# EAGLE design Monitor_strip_5050 (EAGLE 7.3.0)
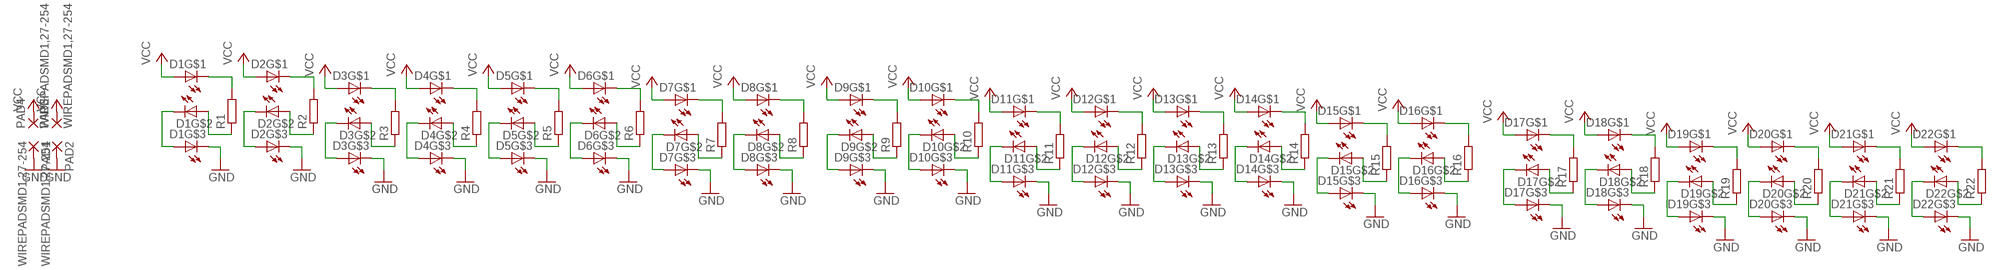
[diagram p0: schematic, sheet 1]

## Parts
D1  LED5050_SEPARATES  [LED505_SMALLPADS]
D2  LED5050_SEPARATES  [LED505_SMALLPADS]
D3  LED5050_SEPARATES  [LED505_SMALLPADS]
D4  LED5050_SEPARATES  [LED505_SMALLPADS]
D5  LED5050_SEPARATES  [LED505_SMALLPADS]
D6  LED5050_SEPARATES  [LED505_SMALLPADS]
D7  LED5050_SEPARATES  [LED505_SMALLPADS]
D8  LED5050_SEPARATES  [LED505_SMALLPADS]
D9  LED5050_SEPARATES  [LED505_SMALLPADS]
D10  LED5050_SEPARATES  [LED505_SMALLPADS]
D11  LED5050_SEPARATES  [LED505_SMALLPADS]
D12  LED5050_SEPARATES  [LED505_SMALLPADS]
D13  LED5050_SEPARATES  [LED505_SMALLPADS]
D14  LED5050_SEPARATES  [LED505_SMALLPADS]
D15  LED5050_SEPARATES  [LED505_SMALLPADS]
D16  LED5050_SEPARATES  [LED505_SMALLPADS]
D17  LED5050_SEPARATES  [LED505_SMALLPADS]
D18  LED5050_SEPARATES  [LED505_SMALLPADS]
D19  LED5050_SEPARATES  [LED505_SMALLPADS]
D20  LED5050_SEPARATES  [LED505_SMALLPADS]
D21  LED5050_SEPARATES  [LED505_SMALLPADS]
D22  LED5050_SEPARATES  [LED505_SMALLPADS]
PAD1  WIREPADSMD1,27-254  [SMD1,27-2,54]
PAD2  WIREPADSMD1,27-254  [SMD1,27-2,54]
PAD3  WIREPADSMD1,27-254  [SMD1,27-2,54]
PAD4  WIREPADSMD1,27-254  [SMD1,27-2,54]
R1  R-EU_R0805  [R0805]
R2  R-EU_R0805  [R0805]
R3  R-EU_R0805  [R0805]
R4  R-EU_R0805  [R0805]
R5  R-EU_R0805  [R0805]
R6  R-EU_R0805  [R0805]
R7  R-EU_R0805  [R0805]
R8  R-EU_R0805  [R0805]
R9  R-EU_R0805  [R0805]
R10  R-EU_R0805  [R0805]
R11  R-EU_R0805  [R0805]
R12  R-EU_R0805  [R0805]
R13  R-EU_R0805  [R0805]
R14  R-EU_R0805  [R0805]
R15  R-EU_R0805  [R0805]
R16  R-EU_R0805  [R0805]
R17  R-EU_R0805  [R0805]
R18  R-EU_R0805  [R0805]
R19  R-EU_R0805  [R0805]
R20  R-EU_R0805  [R0805]
R21  R-EU_R0805  [R0805]
R22  R-EU_R0805  [R0805]

## Nets
GND: D1.P$3(C) D2.P$3(C) D3.P$3(C) D4.P$3(C) D5.P$3(C) D6.P$3(C) D7.P$3(C) D8.P$3(C) D9.P$3(C) D10.P$3(C) D11.P$3(C) D12.P$3(C) D13.P$3(C) D14.P$3(C) D15.P$3(C) D16.P$3(C) D17.P$3(C) D18.P$3(C) D19.P$3(C) D20.P$3(C) D21.P$3(C) D22.P$3(C) PAD1.1(P) PAD2.1(P)
N$1: D1.P$1(C) R1.2
N$2: D1.P$5(A) R1.1
N$3: D2.P$2(C) D2.P$4(A)
N$4: D2.P$1(C) R2.2
N$5: D2.P$5(A) R2.1
N$6: D3.P$2(C) D3.P$4(A)
N$7: D3.P$1(C) R3.2
N$8: D3.P$5(A) R3.1
N$9: D4.P$2(C) D4.P$4(A)
N$10: D1.P$2(C) D1.P$4(A)
N$11: D4.P$1(C) R4.2
N$12: D4.P$5(A) R4.1
N$13: D5.P$2(C) D5.P$4(A)
N$14: D5.P$1(C) R5.2
N$15: D5.P$5(A) R5.1
N$16: D6.P$2(C) D6.P$4(A)
N$17: D6.P$1(C) R6.2
N$18: D6.P$5(A) R6.1
N$19: D7.P$2(C) D7.P$4(A)
N$20: D7.P$1(C) R7.2
N$21: D7.P$5(A) R7.1
N$22: D8.P$2(C) D8.P$4(A)
N$23: D8.P$1(C) R8.2
N$24: D8.P$5(A) R8.1
N$25: D9.P$2(C) D9.P$4(A)
N$26: D9.P$1(C) R9.2
N$27: D9.P$5(A) R9.1
N$28: D10.P$2(C) D10.P$4(A)
N$29: D10.P$1(C) R10.2
N$30: D10.P$5(A) R10.1
N$31: D11.P$2(C) D11.P$4(A)
N$32: D11.P$1(C) R11.2
N$33: D11.P$5(A) R11.1
N$34: D12.P$2(C) D12.P$4(A)
N$35: D12.P$1(C) R12.2
N$36: D12.P$5(A) R12.1
N$37: D13.P$2(C) D13.P$4(A)
N$38: D13.P$1(C) R13.2
N$39: D13.P$5(A) R13.1
N$40: D14.P$2(C) D14.P$4(A)
N$41: D14.P$1(C) R14.2
N$42: D14.P$5(A) R14.1
N$43: D15.P$2(C) D15.P$4(A)
N$44: D15.P$1(C) R15.2
N$45: D15.P$5(A) R15.1
N$46: D16.P$2(C) D16.P$4(A)
N$47: D16.P$1(C) R16.2
N$48: D16.P$5(A) R16.1
N$49: D17.P$2(C) D17.P$4(A)
N$50: D17.P$1(C) R17.2
N$51: D17.P$5(A) R17.1
N$52: D18.P$2(C) D18.P$4(A)
N$53: D18.P$1(C) R18.2
N$54: D18.P$5(A) R18.1
N$55: D19.P$2(C) D19.P$4(A)
N$56: D19.P$1(C) R19.2
N$57: D19.P$5(A) R19.1
N$58: D20.P$2(C) D20.P$4(A)
N$59: D20.P$1(C) R20.2
N$60: D20.P$5(A) R20.1
N$61: D21.P$2(C) D21.P$4(A)
N$62: D21.P$1(C) R21.2
N$63: D21.P$5(A) R21.1
N$64: D22.P$2(C) D22.P$4(A)
N$65: D22.P$1(C) R22.2
N$66: D22.P$5(A) R22.1
VCC: D1.P$6(A) D2.P$6(A) D3.P$6(A) D4.P$6(A) D5.P$6(A) D6.P$6(A) D7.P$6(A) D8.P$6(A) D9.P$6(A) D10.P$6(A) D11.P$6(A) D12.P$6(A) D13.P$6(A) D14.P$6(A) D15.P$6(A) D16.P$6(A) D17.P$6(A) D18.P$6(A) D19.P$6(A) D20.P$6(A) D21.P$6(A) D22.P$6(A) PAD3.1(P) PAD4.1(P)

## Library data of the parts
D1-D22 = Namenlos:LED5050_SEPARATE
PAD1-PAD4 = wirepad:WIREPAD: Wire PAD connect wire on PCB
R1-R22 = rcl:R-EU_: RESISTOR, European symbol

## Board
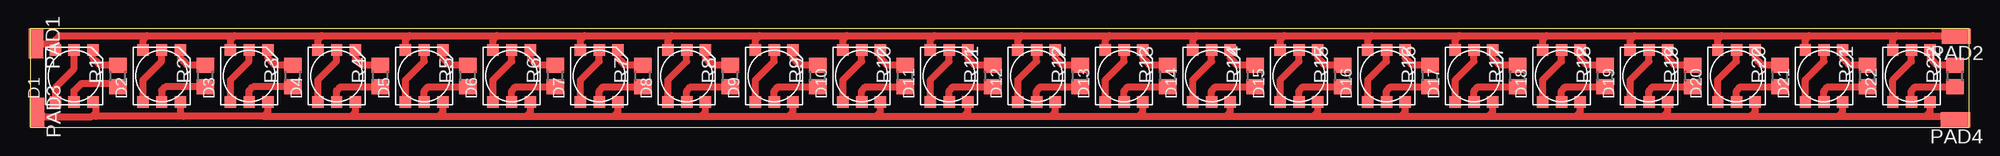
[diagram p1: board, top side]

Size 168.89 x 8.56 mm. Coordinates in mm from the lower left corner, seen from the top.
Outline: 0,0 168.89,0 168.89,8.56 0,8.56 0,0
Copper layers (1*16): Top 0.035mm / dielectric 1.5mm / Bottom 0.035mm
Design rules "default": minimum track width 10mil, minimum drill 24mil, track to track 8mil, track to pad 8mil, pad to pad 8mil, via to via 8mil, smd to smd 8mil, copper to edge 40mil, drill to drill 8mil, minimum pad ring 10mil, minimum via ring 8mil, stop-mask expansion 4mil, vias tented up to drill 0mil, thermal gap 10mil

### Footprints (pad centres in the part's own frame; a part is rotated, then mirrored left to right if it is on the bottom)
LED505_SMALLPADS = smd 1 x 1: P$1 1.616,2.25; P$2 0,2.25; P$3 -1.616,2.25; P$4 -1.616,-2.25; P$5 0,-2.25; P$6 1.616,-2.25
SMD1,27-2,54 = smd 1.27 x 2.54: 1 0,0
R0805 = smd 1.3 x 1.5: 1 -0.95,0; 2 0.95,0

### Placement (x,y rotation side)
D1  3.81,4.45 0 top
D2  11.43,4.45 0 top
D3  19.05,4.45 0 top
D4  26.67,4.45 0 top
D5  34.29,4.45 0 top
D6  41.91,4.45 0 top
D7  49.53,4.45 0 top
D8  57.15,4.45 0 top
D9  64.77,4.45 0 top
D10  72.39,4.45 0 top
D11  80.01,4.45 0 top
D12  87.63,4.45 0 top
D13  95.25,4.45 0 top
D14  102.87,4.45 0 top
D15  110.49,4.45 0 top
D16  118.11,4.45 0 top
D17  125.73,4.45 0 top
D18  133.35,4.45 0 top
D19  140.97,4.45 0 top
D20  148.59,4.45 0 top
D21  156.21,4.45 0 top
D22  163.83,4.45 0 top
PAD1  0.48,7.27 180 top
PAD2  167.74,7.91 90 top
PAD3  0.56,1.29 180 top
PAD4  167.68,0.64 90 top
R1  7.62,4.45 90 top
R2  15.24,4.45 90 top
R3  22.86,4.45 90 top
R4  30.48,4.45 90 top
R5  38.1,4.45 90 top
R6  45.72,4.45 90 top
R7  53.34,4.45 90 top
R8  60.96,4.45 90 top
R9  68.58,4.45 90 top
R10  76.2,4.45 90 top
R11  83.82,4.45 90 top
R12  91.44,4.45 90 top
R13  99.06,4.45 90 top
R14  106.68,4.45 90 top
R15  114.3,4.45 90 top
R16  121.92,4.45 90 top
R17  129.54,4.45 90 top
R18  137.16,4.45 90 top
R19  144.78,4.45 90 top
R20  152.4,4.45 90 top
R21  160.02,4.45 90 top
R22  167.64,4.45 90 top

### Tracks (layer width: path | path; a pad name or v marks a point on that pad's centre or on a via)
GND
  Top 0.61: D1.P$3 2.19,7.61 | 2.19,7.61 2.54,7.96 10.16,7.96 | 10.16,7.96 17.78,7.96 | 17.78,7.96 25.4,7.96 | 25.4,7.96 33.02,7.96 | 33.02,7.96 40.64,7.96 | 40.64,7.96 48.26,7.96 | 48.26,7.96 55.88,7.96 | 55.88,7.96 63.5,7.96 | 63.5,7.96 71.12,7.96 | 71.12,7.96 78.74,7.96 | 78.74,7.96 86.36,7.96 | 86.36,7.96 93.98,7.96 | 93.98,7.96 101.6,7.96 | 101.6,7.96 109.22,7.96 | 109.22,7.96 116.84,7.96 | 116.84,7.96 124.46,7.96 | 124.46,7.96 132.08,7.96 | 132.08,7.96 139.7,7.96 | 139.7,7.96 147.32,7.96 | 147.32,7.96 154.94,7.96 | 154.94,7.96 162.56,7.96 | 162.56,7.96 165.74,7.96 167.69,7.96 PAD2.1 | D22.P$3 162.21,7.61 162.56,7.96 | D21.P$3 154.59,7.61 154.94,7.96 | D20.P$3 146.97,7.61 147.32,7.96 | D19.P$3 139.35,7.61 139.7,7.96 | D18.P$3 131.73,7.61 132.08,7.96 | D17.P$3 124.11,7.61 124.46,7.96 | D16.P$3 116.49,7.61 116.84,7.96 | D15.P$3 108.87,7.61 109.22,7.96 | D14.P$3 101.25,7.61 101.6,7.96 | D13.P$3 93.63,7.61 93.98,7.96 | D12.P$3 86.01,7.61 86.36,7.96 | D11.P$3 78.39,7.61 78.74,7.96 | D10.P$3 70.77,7.61 71.12,7.96 | D9.P$3 63.15,7.61 63.5,7.96 | D8.P$3 55.53,7.61 55.88,7.96 | D7.P$3 47.91,7.61 48.26,7.96 | D6.P$3 40.29,7.61 40.64,7.96 | D5.P$3 32.67,7.61 33.02,7.96 | D4.P$3 25.05,7.61 25.4,7.96 | D3.P$3 17.43,7.61 17.78,7.96 | D2.P$3 9.81,7.61 10.16,7.96 | PAD1.1 1.85,7.27 2.19,7.61
N$1
  Top 0.61: R1.2 6.04,5.39 5.71,5.71 5.43,6 D1.P$1
N$2
  Top 0.61: D1.P$5 3.81,3.17 4.45,3.81 7.3,3.81 R1.1
N$3
  Top 0.61: D2.P$4 9.81,4.1 11.43,5.71 D2.P$2
N$4
  Top 0.61: D2.P$1 13.05,6 13.34,5.71 13.65,5.39 R2.2
N$5
  Top 0.61: R2.1 11.75,3.5 11.43,3.17 D2.P$5
N$6
  Top 0.61: D3.P$4 17.43,4.1 19.05,5.71 D3.P$2
N$7
  Top 0.61: D3.P$1 20.67,6 20.95,5.71 21.27,5.39 R3.2
N$8
  Top 0.61: D3.P$5 19.05,3.17 19.37,3.5 R3.1
N$9
  Top 0.61: D4.P$4 25.05,4.1 26.67,5.71 D4.P$2
N$10
  Top 0.61: D1.P$4 2.19,3.46 3.81,5.08 D1.P$2
N$11
  Top 0.61: D4.P$1 28.29,6 28.57,5.71 28.89,5.39 R4.2
N$12
  Top 0.61: D4.P$5 26.67,3.17 26.99,3.5 R4.1
N$13
  Top 0.61: D5.P$4 32.67,4.1 34.29,5.71 D5.P$2
N$14
  Top 0.61: D5.P$1 35.91,6 | 35.91,6 36.2,5.71 | R5.2 36.52,5.39 35.91,6
N$15
  Top 0.61: D5.P$5 34.29,3.17 34.61,3.5 R5.1
N$16
  Top 0.61: D6.P$4 40.29,4.1 41.91,5.71 D6.P$2
N$17
  Top 0.61: D6.P$1 43.53,6 43.81,5.71 44.13,5.39 R6.2
N$18
  Top 0.61: D6.P$5 41.91,3.17 42.23,3.5 R6.1
N$19
  Top 0.61: D7.P$4 47.91,4.1 49.53,5.71 D7.P$2
N$20
  Top 0.61: D7.P$1 51.15,6 51.44,5.71 51.76,5.39 R7.2
N$21
  Top 0.61: D7.P$5 49.53,3.17 49.85,3.5 R7.1
N$22
  Top 0.61: D8.P$4 55.53,4.1 57.15,5.71 D8.P$2
N$23
  Top 0.61: D8.P$1 58.77,6 59.05,5.71 59.38,5.39 R8.2
N$24
  Top 0.61: D8.P$5 57.15,3.17 57.47,3.5 R8.1
N$25
  Top 0.61: D9.P$4 63.15,4.1 64.77,5.71 D9.P$2
N$26
  Top 0.61: D9.P$1 66.39,6 66.67,5.71 67,5.39 R9.2
N$27
  Top 0.61: D9.P$5 64.77,3.17 65.09,3.5 R9.1
N$28
  Top 0.61: D10.P$4 70.77,4.1 72.39,5.71 D10.P$2
N$29
  Top 0.61: D10.P$1 74.01,6 74.3,5.71 74.61,5.39 R10.2
N$30
  Top 0.61: D10.P$5 72.39,3.17 72.71,3.5 R10.1
N$31
  Top 0.61: D11.P$4 78.39,4.1 80.01,5.71 D11.P$2
N$32
  Top 0.61: D11.P$1 81.63,6 81.92,5.71 82.23,5.39 R11.2
N$33
  Top 0.61: D11.P$5 80.01,3.17 80.33,3.5 R11.1
N$34
  Top 0.61: D12.P$4 86.01,4.1 87.63,5.71 D12.P$2
N$35
  Top 0.61: D12.P$1 89.25,6 89.53,5.71 89.86,5.39 R12.2
N$36
  Top 0.61: D12.P$5 87.63,3.17 87.95,3.5 R12.1
N$37
  Top 0.61: D13.P$4 93.63,4.1 95.25,5.71 D13.P$2
N$38
  Top 0.61: D13.P$1 96.87,6 97.16,5.71 97.47,5.39 R13.2
N$39
  Top 0.61: D13.P$5 95.25,3.17 95.57,3.5 R13.1
N$40
  Top 0.61: D14.P$4 101.25,4.1 102.87,5.71 D14.P$2
N$41
  Top 0.61: D14.P$1 104.49,6 104.78,5.71 105.09,5.39 R14.2
N$42
  Top 0.61: D14.P$5 102.87,3.17 103.19,3.5 R14.1
N$43
  Top 0.61: D15.P$4 108.87,4.1 110.49,5.71 D15.P$2
N$44
  Top 0.61: D15.P$1 112.11,6 112.39,5.71 112.72,5.39 R15.2
N$45
  Top 0.61: D15.P$5 110.49,3.17 110.81,3.5 R15.1
N$46
  Top 0.61: D16.P$4 116.49,4.1 118.11,5.71 D16.P$2
N$47
  Top 0.61: D16.P$1 119.73,6 120.02,5.71 120.33,5.39 R16.2
N$48
  Top 0.61: D16.P$5 118.11,3.17 118.43,3.5 R16.1
N$49
  Top 0.61: D17.P$4 124.11,4.1 125.73,5.71 D17.P$2
N$50
  Top 0.61: D17.P$1 127.35,6 127.64,5.71 127.95,5.39 R17.2
N$51
  Top 0.61: D17.P$5 125.73,3.17 126.05,3.5 R17.1
N$52
  Top 0.61: D18.P$4 131.73,4.1 133.35,5.71 D18.P$2
N$53
  Top 0.61: D18.P$1 134.97,6 135.25,5.71 135.57,5.39 R18.2
N$54
  Top 0.61: D18.P$5 133.35,3.17 133.67,3.5 R18.1
N$55
  Top 0.61: D19.P$4 139.35,4.1 140.97,5.71 D19.P$2
N$56
  Top 0.61: D19.P$1 142.59,6 142.88,5.71 143.19,5.39 R19.2
N$57
  Top 0.61: D19.P$5 140.97,3.17 141.29,3.5 R19.1
N$58
  Top 0.61: D20.P$4 146.97,4.1 148.59,5.71 D20.P$2
N$59
  Top 0.61: D20.P$1 150.21,6 150.5,5.71 150.81,5.39 R20.2
N$60
  Top 0.61: D20.P$5 148.59,3.17 148.91,3.5 R20.1
N$61
  Top 0.61: D21.P$4 154.59,4.1 156.21,5.71 D21.P$2
N$62
  Top 0.61: D21.P$1 157.83,6 158.12,5.71 158.44,5.39 R21.2
N$63
  Top 0.61: D21.P$5 156.21,3.17 156.53,3.5 R21.1
N$64
  Top 0.61: D22.P$4 162.21,4.1 163.83,5.71 D22.P$2
N$65
  Top 0.61: D22.P$1 165.45,6 165.74,5.71 166.06,5.39 R22.2
N$66
  Top 0.61: D22.P$5 163.83,3.17 164.15,3.5 R22.1
VCC
  Top 0.61: 20.32,0.94 13.34,0.94 | 13.34,0.94 5.71,0.94 5.71,1.27 | 5.71,1.27 5.71,1.91 D1.P$6 | D2.P$6 13.05,1.22 13.34,0.94 | 20.32,0.94 27.94,0.94 | 27.94,0.94 35.56,0.94 | 35.56,0.94 43.18,0.94 | 43.18,0.94 50.8,0.94 | 50.8,0.94 58.42,0.94 | 58.42,0.94 66.04,0.94 | 66.04,0.94 73.66,0.94 | 73.66,0.94 81.28,0.94 | 81.28,0.94 88.9,0.94 | 88.9,0.94 96.52,0.94 | 96.52,0.94 104.14,0.94 | 104.14,0.94 111.76,0.94 | 111.76,0.94 119.38,0.94 | 119.38,0.94 127,0.94 | 127,0.94 134.62,0.94 | 134.62,0.94 142.24,0.94 | 142.24,0.94 149.86,0.94 | 149.86,0.94 157.48,0.94 | 157.48,0.94 165.1,0.94 | 165.1,0.94 165.74,0.94 167.38,0.94 PAD4.1 | D22.P$6 165.45,1.28 165.1,0.94 | D21.P$6 157.83,1.28 157.48,0.94 | D20.P$6 150.21,1.28 149.86,0.94 | D19.P$6 142.59,1.28 142.24,0.94 | D18.P$6 134.97,1.28 134.62,0.94 | D17.P$6 127.35,1.28 127,0.94 | D16.P$6 119.73,1.28 119.38,0.94 | D15.P$6 112.11,1.28 111.76,0.94 | D14.P$6 104.49,1.28 104.14,0.94 | D13.P$6 96.87,1.28 96.52,0.94 | D12.P$6 89.25,1.28 88.9,0.94 | D11.P$6 81.63,1.28 81.28,0.94 | D10.P$6 74.01,1.28 73.66,0.94 | D9.P$6 66.39,1.28 66.04,0.94 | D8.P$6 58.77,1.28 58.42,0.94 | D7.P$6 51.15,1.28 50.8,0.94 | D6.P$6 43.53,1.28 43.18,0.94 | D5.P$6 35.91,1.28 35.56,0.94 | D4.P$6 28.29,1.28 27.94,0.94 | D3.P$6 20.67,1.28 20.32,0.94 | PAD3.1 0.81,1.29 1.2,0.9 5.34,0.9 5.71,1.27